# Altium project powerboard.PrjPcb
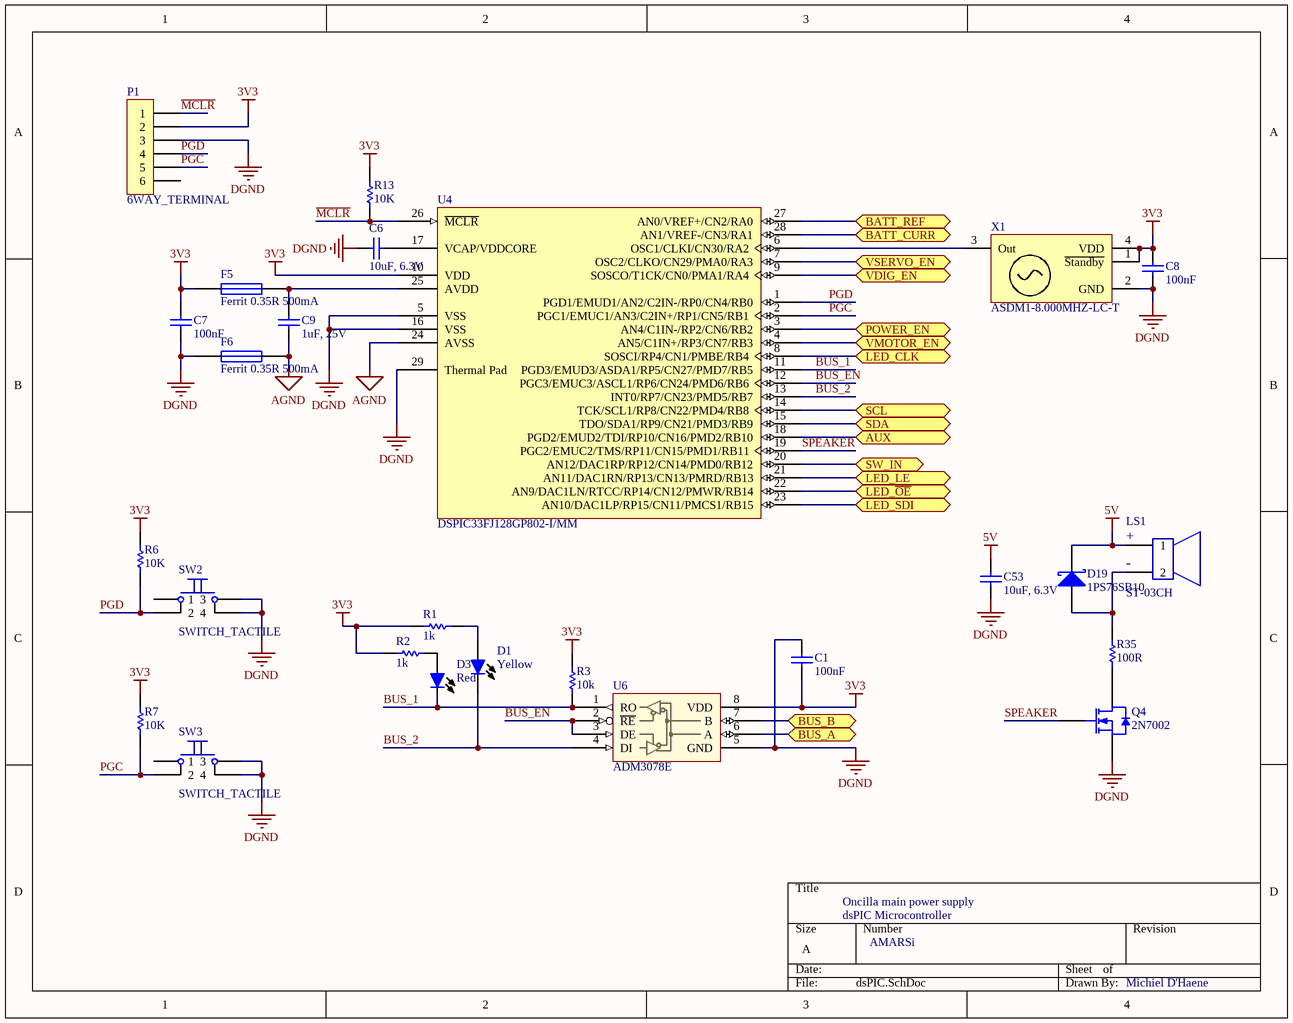
[diagram p0: dsPIC.SchDoc]
title: Vbusm (Biorob)
7 sheets, 154 parts. Net scope: flat (ports and power ports of the same name join across sheets).
Board file: powerboard_4layer.PcbDoc
Sheets:
  dsPIC.SchDoc
  Power_24V.SchDoc
  Connectors.SchDoc
  CurrentSensor.SchDoc
  Power_6V.SchDoc
  Power_onboard.SchDoc
  Leds.SchDoc

## Sheet dsPIC.SchDoc: Vbusm (Biorob)
size A

### Parts
C1  100nF  [CAPC1608L]
C6  10uF, 6.3V  [CAPC1608L]
C7  100nF  [CAPC1608L]
C8  100nF  [CAPC1608L]
C9  1uF, 25V  [CAPC1608L]
C53  value 10uF, 6.3V  [CAPC1608L]  (hidden comment: 1uF, 25V)
D1  Color: Yellow  [CD1608-0603]  (hidden comment: LED Yellow)
D3  Color: Red  [CD1608-0603]  (hidden comment: LED Red)
D19  1PS76SB10  [SOD323]
F5  Ferrit 0.35R 500mA  [RESC1608L]
F6  Ferrit 0.35R 500mA  [RESC1608L]
LS1  ST-03CH  [PIEZO_8.5x8.5MM]
P1  6WAY_TERMINAL  [MICROMATCH_6WAY_SE]
Q4  2N7002  [SOT23_N]
R1  1k  [RESC1608L]
R2  1k  [RESC1608L]
R3  10k  [RESC1608L]
R6  10k  [RESC1608L]
R7  10k  [RESC1608L]
R13  10k  [RESC1608L]
R35  100R  [RESC2012L]
SW2  SWITCH_TACTILE  [TACTILE_SWITCH]
SW3  SWITCH_TACTILE  [TACTILE_SWITCH]
U4  DSPIC33FJ128GP802-I/MM  [QFNS-MM28_N]
U6  ADM3078E  [SOIC-8_M]
X1  ASDM1-8.000MHZ-LC-T  [Crystal-Oscillator-2520]

### Ports
AUX, BATT_CURR, BATT_REF, BUS_A, BUS_B, LED_CLK, LED_LE, LED_SDI, LED_~{OE}, POWER_EN, SCL, SDA, SW_IN, VDIG_EN, VMOTOR_EN, VSERVO_EN

### Nets
3V3: C1.1 C7.2 C8.2 F5.1 P1.2 R1.1 R2.1 R3.2 R6.2 R7.2 R13.2 U4.10(VDD) U6.8(VDD) X1.1(~{Standby}) X1.4(VDD)
5V: C53.1 D19.1(K) LS1.1
AGND: C9.1 F6.2 U4.24(AVSS)
DGND: C1.2 C6.1 C7.1 C8.1 C53.2 F6.1 P1.3 Q4.2(S) SW2.3 SW2.4 SW3.3 SW3.4 U4.5(VSS) U4.16(VSS) U4.29(Thermal_Pad) U6.5(GND) X1.2(GND)
BUS_1: D3.2(C) R3.1 U4.11(PGD3/EMUD3/ASDA1/RP5/CN27/PMD7/RB5) U6.1(RO)
BUS_2: D1.2(C) U4.13(INT0/RP7/CN23/PMD5/RB7) U6.4(DI)
BUS_EN: U4.12(PGC3/EMUC3/ASCL1/RP6/CN24/PMD6/RB6) U6.2(~{RE}) U6.3(DE)
~{MCLR}: P1.1 R13.1 U4.26(~{MCLR})
PGC: P1.5 R7.1 SW3.2 U4.2(PGC1/EMUC1/AN3/C2IN+/RP1/CN5/RB1)
PGD: P1.4 R6.1 SW2.2 U4.1(PGD1/EMUD1/AN2/C2IN-/RP0/CN4/RB0)
SPEAKER: Q4.1(G) U4.19(PGC2/EMUC2/TMS/RP11/CN15/PMD1/RB11)
NetC4_2: U4.28(AN1/VREF-/CN3/RA1) ; port BATT_CURR
NetC6_2: C6.2 U4.17(VCAP/VDDCORE)
NetC9_2: C9.2 F5.2 U4.25(AVDD)
NetC43_2: U4.27(AN0/VREF+/CN2/RA0) ; port BATT_REF
NetD1_1: D1.1(A) R1.2
NetD3_1: D3.1(A) R2.2
NetD17_3: U4.20(AN12/DAC1RP/RP12/CN14/PMD0/RB12) ; port SW_IN
NetD19_2: D19.2(A) LS1.2 R35.1
NetP5_2: U6.6(A) ; port BUS_A
NetP5_3: U6.7(B) ; port BUS_B
NetP9_3: U4.14(TCK/SCL1/RP8/CN22/PMD4/RB8) ; port SCL
NetP9_4: U4.15(TDO/SDA1/RP9/CN21/PMD3/RB9) ; port SDA
NetP9_5: U4.18(PGD2/EMUD2/TDI/RP10/CN16/PMD2/RB10) ; port AUX
NetQ3_1: U4.3(AN4/C1IN-/RP2/CN6/RB2) ; port POWER_EN
NetQ4_3: Q4.3(D) R35.2
NetR37_2: U4.7(OSC2/CLKO/CN29/PMA0/RA3) ; port VSERVO_EN
NetR38_2: U4.9(SOSCO/T1CK/CN0/PMA1/RA4) ; port VDIG_EN
NetR39_2: U4.4(AN5/C1IN+/RP3/CN7/RB3) ; port VMOTOR_EN
NetU4_6: U4.6(OSC1/CLKI/CN30/RA2) X1.3(Out)
NetU4_8: U4.8(SOSCI/RP4/CN1/PMBE/RB4) ; port LED_CLK
NetU4_21: U4.21(AN11/DAC1RN/RP13/CN13/PMRD/RB13) ; port LED_LE
NetU4_22: U4.22(AN9/DAC1LN/RTCC/RP14/CN12/PMWR/RB14) ; port LED_~{OE}
NetU4_23: U4.23(AN10/DAC1LP/RP15/CN11/PMCS1/RB15) ; port LED_SDI

Not connected (* = marked no-connect by the designer): P1 6; SW2 1; SW3 1

### Notes on the sheet
- Oncilla main power supply
- dsPIC Microcontroller
- AMARSi
- Michiel D'Haene
- (in symbol piezo_sounder) +; -

### Library data of the parts
C1 C6-C9 C53 = Cap Semi: Capacitor (Semiconductor SIM Model); Published: 8-Jun-2000; LatestRevisionDate: 29-May-2009; LatestRevisionNote: IPC-7351 Footprint Added.; PackageReference: C1206; Publisher: Altium Limited; PackageDescription: Chip Capacitor
  C1 C7 C8: Value: 100nF
  C6: Value: 10uF, 6.3V
  C9: Value: 1uF, 25V
D1 D3 = LED
D19 = 1PS76SB10: Schottky Barrier Diode; Published: 17-Sep-2003; LatestRevisionDate: 19-Mar-2004; LatestRevisionNote: Silkscreen size reduced.; DatasheetVersion: 14-Oct-1996; PackageVersion: May-1999; PackageReference: SOD323; Publisher: Altium Limited; PackageDescription: SOD-323/SC-76; 2 Leads; Body 1.7 x 1.3 mm, (LxW); ComponentLink1Description: Manufacturer Link; ComponentLink1URL: http://www.semiconductors.philips.com/; ComponentLink2Description: Datasheet; ComponentLink2URL: http://www.semiconductors.philips.com/acrobat/datasheets/1PS76SB10_2.pdf
F5 F6 = Fuse 1: Ferrit Bead; Published: 8-Jun-2000; LatestRevisionDate: 17-Jul-2002; LatestRevisionNote: Re-released for DXP Platform.; PackageReference: PIN-W2/E2.8; Publisher: Altium Limited
LS1 = piezo_sounder
Q4 = BST82: N-channel Enhancement Mode Field-effect Transistor; Published: 17-Sep-2003; LatestRevisionDate: 12-Dec-2006; LatestRevisionNote: IPC-7351 Footprint Added.; DatasheetVersion: 26-Jul-2000; PackageVersion: May-1999; PackageReference: SOT23; Publisher: Altium Limited; PackageDescription: 3-Pin SOT-23 Package 0.95 mm Pitch, 2.3 mm Lead Span; ComponentLink1Description: Manufacturer Link; ComponentLink1URL: http://www.semiconductors.philips.com/; ComponentLink2Description: Datasheet; ComponentLink2URL: http://www.semiconductors.philips.com/acrobat/datasheets/BST82-03.pdf
R1-R3 R6 R7 R13 R35 = Res Semi: Semiconductor Resistor; Published: 8-Jun-2000; LatestRevisionDate: 17-Jul-2002; LatestRevisionNote: Re-released for DXP Platform.; PackageReference: AXIAL-0.5; Publisher: Altium Limited
  R1 R2: Value: 1k
  R3: Value: 10k
  R6 R7 R13: Value: 10K
  R35: Value: 100R
U4 = DSPIC33FJ128GP802T-I/MM: High-Performance 16-bit Digital Signal Controller, 128 KB Flash, 16 KB RAM, 28-Pin QFN, Industrial Temperature, Tape and Reel; FirstPublished: 29-Jan-2009; LatestRevisionDate: 02-Dec-2009; LatestRevisionNote: Updated to datasheet revision D, Nov-2009; DatasheetVersion: revD, Nov-2009; PackageVersion: revBB, Aug-2009; PackageReference: QFNS-MM28; Publisher: Altium Limited; PackageDescription: 28-Lead Plastic Quad Flat, No Lead Package (MM) - 6x6x0.9 mm Body [QFN-S] with 0.40 mm Contact Length; Supplier 1: Digi-Key; Supplier Part Number 1: DSPIC33FJ128GP802T-I/MMTR-ND; Supplier 2: Newark; Supplier Part Number 2: 54M4502; ComponentLink1Description: Datasheet; ComponentLink1URL: http://ww1.microchip.com/downloads/en/DeviceDoc/70292D.pdf; ComponentLink2Description: Packaging Specification; ComponentLink2URL: http://www.microchip.com/stellent/groups/techpub_sg/documents/packagingspec/en012702.pdf; ComponentLink3Description: Microchip.com Home; ComponentLink3URL: http://www.microchip.com/
U6 = ADM3078E: Half-Duplex RS485 Transciever, 3.3V, 16Mbps
X1 = Oscillator: Name: ASDM1; Value: 8MHz

## Sheet Power_24V.SchDoc: Vbusm (Biorob)
size A4; DocumentNumber: 2; SheetNumber: 2; SheetTotal: 4
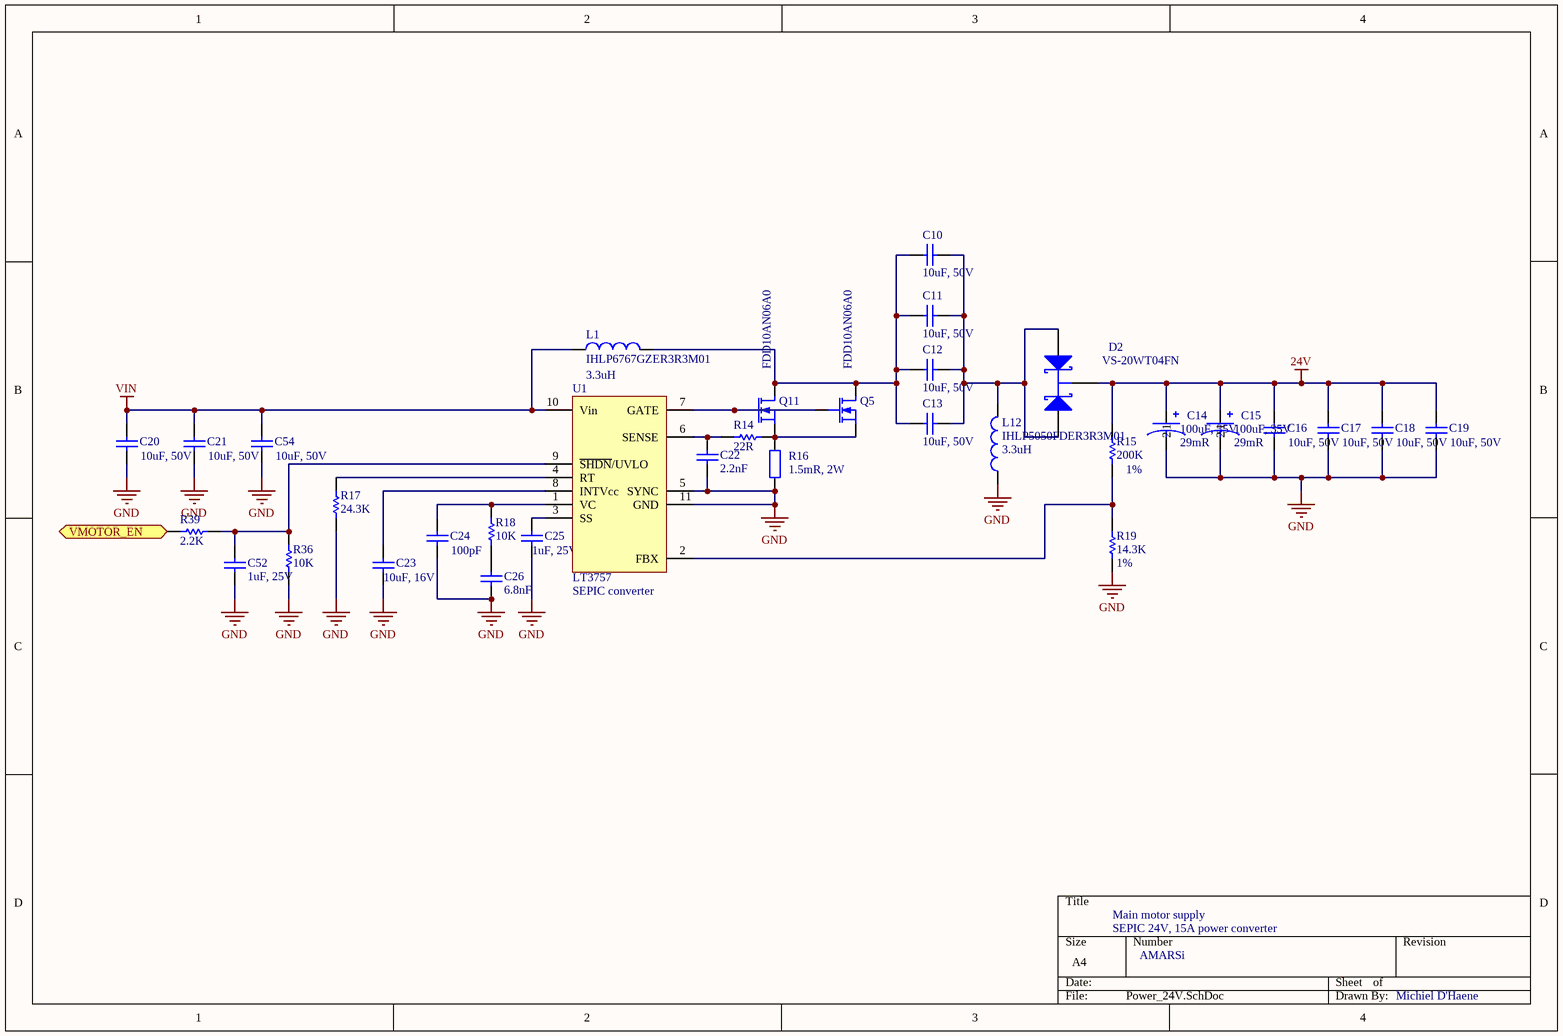
[diagram p1: Power_24V.SchDoc]

### Parts
C10  10uF, 50V  [CAPC3216L]
C11  10uF, 50V  [CAPC3216L]
C12  10uF, 50V  [CAPC3216L]
C13  10uF, 50V  [CAPC3216L]
C14  value 100uF, 35V  ESR: 29mR  [CAP_POL_SMD_SIZE_G]  (hidden comment: 100uF, 35V, 29mR)
C15  value 100uF, 35V  ESR: 29mR  [CAP_POL_SMD_SIZE_G]  (hidden comment: 100uF, 35V, 29mR)
C16  10uF, 50V  [CAPC3216L]
C17  10uF, 50V  [CAPC3216L]
C18  10uF, 50V  [CAPC3216L]
C19  10uF, 50V  [CAPC3216L]
C20  10uF, 50V  [CAPC3216L]
C21  10uF, 50V  [CAPC3216L]
C22  2.2nF  [CAPC1608L]
C23  10uF, 16V  [CAPC2512L]
C24  100pF  [CAPC1608L]
C25  1uF, 25V  [CAPC1608L]
C26  6.8nF  [CAPC1608L]
C52  1uF, 25V  [CAPC1608L]
C54  10uF, 50V  [CAPC3216L]
D2  VS-20WT04FN  [TO-252AA]
L1  IHLP6767GZER3R3M01  value 3.3uH  [IHLP-6767GZ]
L12  IHLP5050FDER3R3M01  value 3.3uH  [IHLP5050]
Q5  FDD10AN06A0  [TO-252A DPak]
Q11  FDD10AN06A0  [TO-252A DPak]
R14  22R  [RESC1608L]
R15  value 200K  Precision: 1%  [RESC1608L]  (hidden comment: 200K, 1%)
R16  1.5mR, 2W  [RESC6332N]
R17  24.3K  [RESC1608L]
R18  10K  [RESC1608L]
R19  value 14.3K  Precision: 1%  [RESC1608L]  (hidden comment: 14.3K, 1%)
R36  10K  [RESC1608L]
R39  2.2k  [RESC1608L]
U1  LT3757  [MSOP-10-TP]

### Ports
VMOTOR_EN

### Nets
24V: C14.2 C15.2 C16.2 C17.2 C18.2 C19.2 D2.4(K) R15.2
GND: C14.1 C15.1 C16.1 C17.1 C18.1 C19.1 C20.1 C21.1 C22.1 C23.1 C24.1 C25.1 C26.1 C52.1 C54.1 L12.1 R16.1 R17.1 R19.1 R36.1 U1.5(SYNC) U1.11(GND)
VIN: C20.2 C21.2 C54.2 L1.1 U1.10(Vin)
NetC10_1: C10.1 C11.1 C12.1 C13.1 D2.1(A1) D2.3(A2) L12.2
NetC10_2: C10.2 C11.2 C12.2 C13.2 L1.2 Q5.D Q11.D
NetC22_2: C22.2 R14.1 U1.6(SENSE)
NetC23_2: C23.2 U1.8(INTVcc)
NetC24_2: C24.2 R18.2 U1.1(VC)
NetC25_2: C25.2 U1.3(SS)
NetC26_2: C26.2 R18.1
NetC52_2: C52.2 R36.2 R39.1 U1.9(~{SHDN}/UVLO)
NetQ5_G: Q5.G Q11.G U1.7(GATE)
NetQ5_S: Q5.S Q11.S R14.2 R16.2
NetR15_1: R15.1 R19.2 U1.2(FBX)
NetR17_2: R17.2 U1.4(RT)
NetR39_2: R39.2 ; port VMOTOR_EN

### Notes on the sheet
- (near U1) SEPIC converter
- Main motor supply
- SEPIC 24V, 15A power converter
- AMARSi
- Michiel D'Haene

### Library data of the parts
C10-C13 C16-C22 C52 C54 = Cap Semi: Capacitor (Semiconductor SIM Model); Published: 8-Jun-2000; LatestRevisionDate: 29-May-2009; LatestRevisionNote: IPC-7351 Footprint Added.; PackageReference: C1206; Publisher: Altium Limited; PackageDescription: Chip Capacitor
  C10-C13 C16-C21 C54: Value: 10uF; Voltage: 50V
  C22: Value: 2.2nF
  C52: Value: 1uF, 25V
C14 C15 = CAP_POL
C23 = Cap Semi: Capacitor (Semiconductor SIM Model); Voltage: 10V; Published: 8-Jun-2000; LatestRevisionDate: 29-May-2009; LatestRevisionNote: IPC-7351 Footprint Added.; PackageReference: C0805; Publisher: Altium Limited; PackageDescription: Chip Capacitor; Value: 10uF
C24-C26 = Cap: Capacitor; Published: 8-Jun-2000; LatestRevisionDate: 17-Jul-2002; LatestRevisionNote: Re-released for DXP Platform.; PackageReference: RAD-0.3; Publisher: Altium Limited
  C25: Value: 1uF, 25V
D2 = 12CWQ06FN: Schottky Rectifier; Note: Pin 2 is trimmed and not drawn; Published: 8-Jun-2000; LatestRevisionDate: 17-Jul-2002; LatestRevisionNote: Re-released for DXP Platform.; DatasheetDocument: Apr-1997; PackageDocument: Feb-2003; PackageReference: TO-252AA; Publisher: Altium Limited; Code_JEDEC: TO-252-AA; ComponentLink1Description: Manufacturer Link; ComponentLink1URL: http://www.irf.com/; ComponentLink2Description: Datasheet; ComponentLink2URL: http://www.irf.com/product-info/datasheets/data/12cwq06fn.pdf
L1 = Inductor
L12 = Inductor: Code_IEC: 1005; Published: 8-Jun-2000; LatestRevisionDate: 17-Jul-2002; LatestRevisionNote: Re-released for DXP Platform.; PackageReference: 0402-A; Publisher: Altium Limited; Code_JEITA: 0402
Q5 Q11 = nFET: N-Channel MOSFET; pin to pad: D>4 G>1 S>3
R14 R15 R17-R19 R36 = Res Semi: Semiconductor Resistor; Published: 8-Jun-2000; LatestRevisionDate: 17-Jul-2002; LatestRevisionNote: Re-released for DXP Platform.; PackageReference: AXIAL-0.5; Publisher: Altium Limited
  R14: Value: 22R
  R17: Value: 24.3K
  R18 R36: Value: 10K
R16 = Res2: Resistor; Published: 8-Jun-2000; LatestRevisionDate: 17-Jul-2002; LatestRevisionNote: Re-released for DXP Platform.; PackageReference: AXIAL-0.4; Publisher: Altium Limited; Value: 1.5mR, 2W
R39 = Res Semi: Semiconductor Resistor; Precision: 5%; Published: 8-Jun-2000; LatestRevisionDate: 17-Jul-2002; LatestRevisionNote: Re-released for DXP Platform.; PackageReference: AXIAL-0.5; Publisher: Altium Limited; Value: 2.2K
U1 = LT3757: 2.9-40V SEPIC, Flyback, Boost and Inverting Converter with external switch

## Sheet Connectors.SchDoc: Vbusm (Biorob)
size A4; DocumentNumber: 4; SheetNumber: 4; SheetTotal: 4
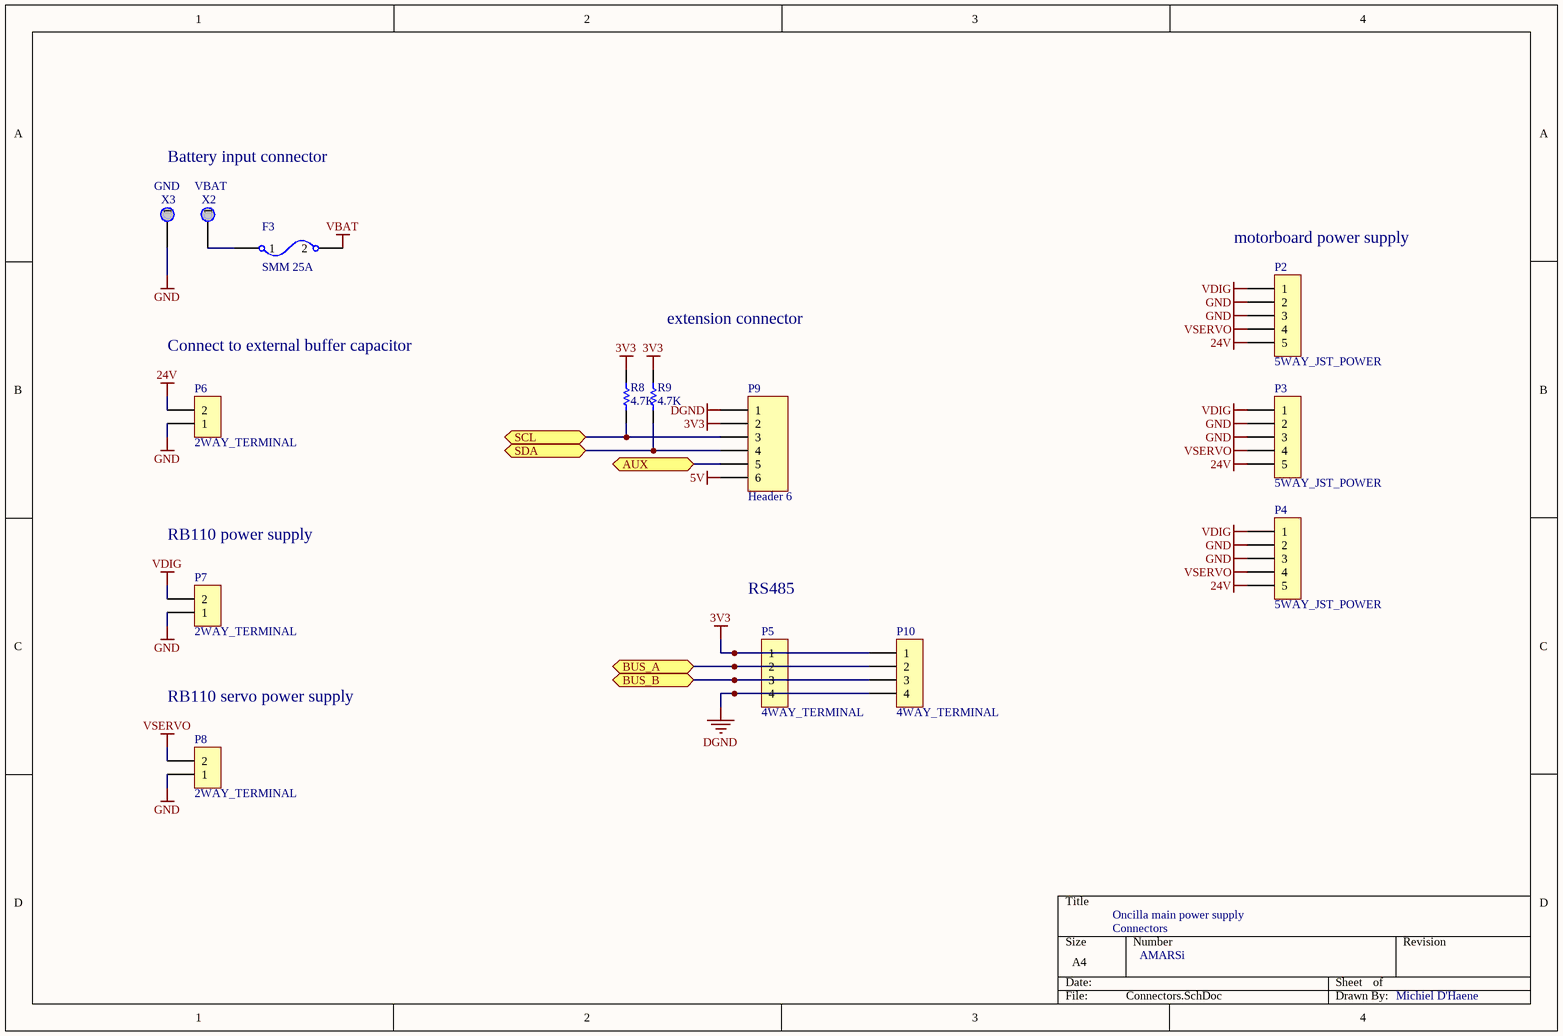
[diagram p2: Connectors.SchDoc]

### Parts
F3  SMM 25A  [FUSE SMM]
P2  5WAY_JST_POWER  [TERMINAL_5WAY_35]
P3  5WAY_JST_POWER  [TERMINAL_5WAY_35]
P4  5WAY_JST_POWER  [TERMINAL_5WAY_35]
P5  4WAY_TERMINAL  [MICROMATCH_4WAY_SE]
P6  2WAY_TERMINAL  [TYCO_2WAY_35MM]
P7  2WAY_TERMINAL  [TYCO_2WAY_35MM]
P8  2WAY_TERMINAL  [TYCO_2WAY_35MM]
P9  Header 6  [HDR1X6]
P10  4WAY_TERMINAL  [MICROMATCH_4WAY_SE]
R8  4.7k  [RESC1608L]
R9  4.7k  [RESC1608L]
X2  VBAT  [TESTPIN 2MM]
X3  GND  [TESTPIN 2MM]

### Ports
AUX, BUS_A, BUS_B, SCL, SDA

### Nets
3V3: P5.1 P9.2 P10.1 R8.2 R9.2
5V: P9.6
24V: P2.5 P3.5 P4.5 P6.2
DGND: P5.4 P9.1 P10.4
GND: P2.2 P2.3 P3.2 P3.3 P4.2 P4.3 P6.1 P7.1 P8.1 X3.1
VBAT: F3.2
VDIG: P2.1 P3.1 P4.1 P7.2
VSERVO: P2.4 P3.4 P4.4 P8.2
NetF3_1: F3.1 X2.1
NetP5_2: P5.2 P10.2 ; port BUS_A
NetP5_3: P5.3 P10.3 ; port BUS_B
NetP9_3: P9.3 R8.1 ; port SCL
NetP9_4: P9.4 R9.1 ; port SDA
NetP9_5: P9.5 ; port AUX

### Notes on the sheet
- Battery input connector
- (near P2) motorboard power supply
- Connect to external buffer capacitor
- extension connector
- RB110 power supply
- RS485
- RB110 servo power supply
- Oncilla main power supply
- Connectors
- AMARSi
- Michiel D'Haene

### Library data of the parts
F3 = fuse
P9 = Header 6: Header, 6-Pin; LatestRevisionDate: 17-Jul-2002; LatestRevisionNote: Re-released for DXP Platform.; Publisher: Altium Limited
R8 R9 = Res Semi: Semiconductor Resistor; Published: 8-Jun-2000; LatestRevisionDate: 17-Jul-2002; LatestRevisionNote: Re-released for DXP Platform.; PackageReference: AXIAL-0.5; Publisher: Altium Limited; Value: 4.7K
X2 X3 = 1WAY_TERMINAL

## Sheet CurrentSensor.SchDoc: Vbusm (Biorob)
size A4; DocumentNumber: 3; SheetNumber: 3; SheetTotal: 4
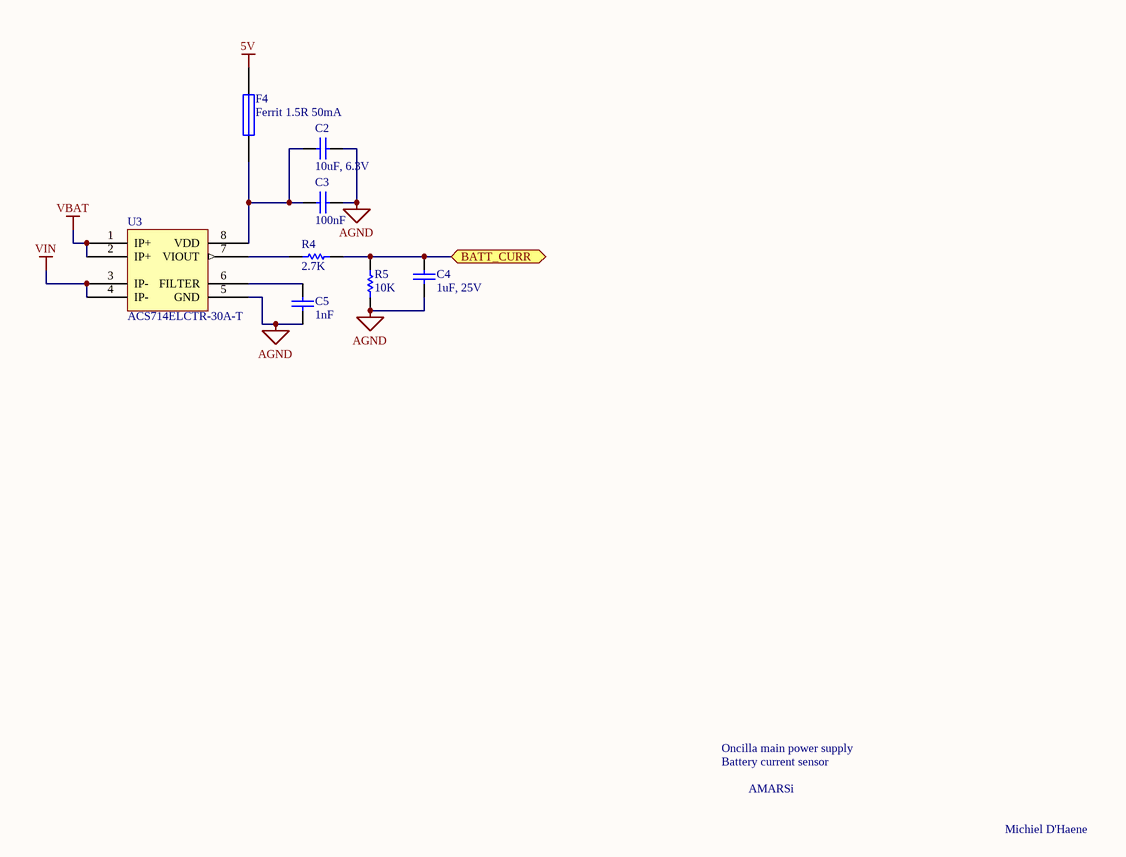
[diagram p3: CurrentSensor.SchDoc]

### Parts
C2  10uF, 6.3V  [CAPC1608L]
C3  100nF  [CAPC1608L]
C4  1uF, 25V  [CAPC1608L]
C5  1nF  [CAPC1608L]
F4  Ferrit 1.5R 50mA  [RESC1608L]
R4  2.7k  [RESC1608L]
R5  10k  [RESC1608L]
U3  ACS714ELCTR-30A-T  [SOIC-8_M]

### Ports
BATT_CURR

### Nets
5V: F4.2
AGND: C2.2 C3.2 C4.1 C5.1 R5.1 U3.5(GND)
VBAT: U3.1(IP+) U3.2(IP+)
VIN: U3.3(IP-) U3.4(IP-)
NetC2_1: C2.1 C3.1 F4.1 U3.8(VDD)
NetC4_2: C4.2 R4.1 R5.2 ; port BATT_CURR
NetC5_2: C5.2 U3.6(FILTER)
NetR4_2: R4.2 U3.7(VIOUT)

### Notes on the sheet
- Oncilla main power supply
- Battery current sensor
- AMARSi
- Michiel D'Haene

### Library data of the parts
C2-C5 = Cap Semi: Capacitor (Semiconductor SIM Model); Published: 8-Jun-2000; LatestRevisionDate: 29-May-2009; LatestRevisionNote: IPC-7351 Footprint Added.; PackageReference: C1206; Publisher: Altium Limited; PackageDescription: Chip Capacitor
  C2: Value: 10uF, 6.3V
  C3: Value: 100nF
  C4: Value: 1uF, 25V
  C5: Value: 1nF
F4 = Fuse 1: Ferrit Bead; Published: 8-Jun-2000; LatestRevisionDate: 17-Jul-2002; LatestRevisionNote: Re-released for DXP Platform.; PackageReference: PIN-W2/E2.8; Publisher: Altium Limited
R4 R5 = Res Semi: Semiconductor Resistor; Published: 8-Jun-2000; LatestRevisionDate: 17-Jul-2002; LatestRevisionNote: Re-released for DXP Platform.; PackageReference: AXIAL-0.5; Publisher: Altium Limited
  R4: Value: 2.7K
  R5: Value: 10K
U3 = ACS714: Hall Effect-Based Linear Current Sensor

## Sheet Power_6V.SchDoc: Vbusm (Biorob)
size A
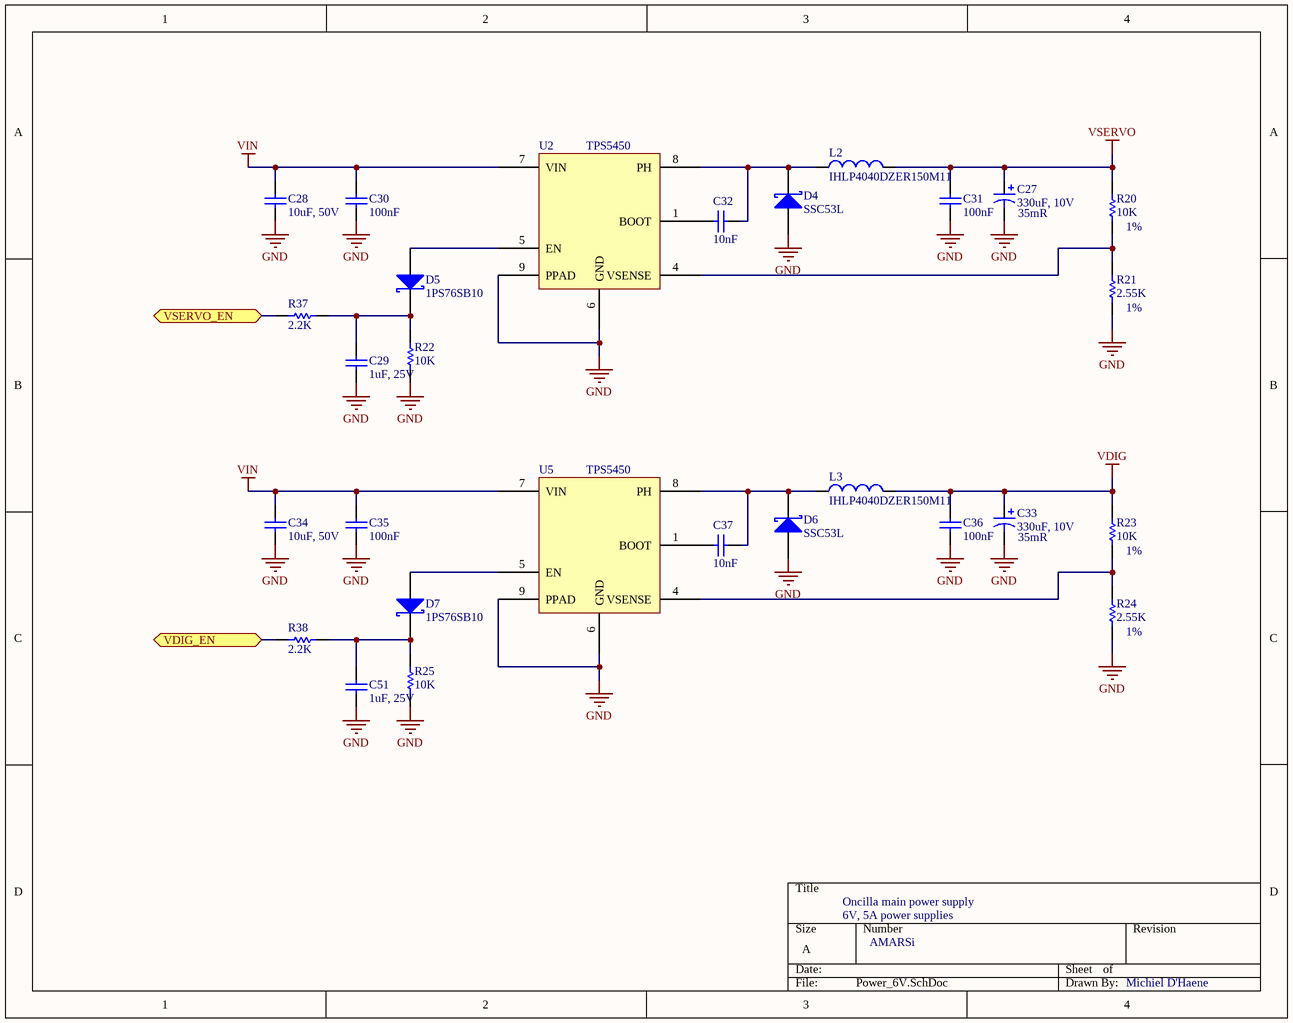
[diagram p4: Power_6V.SchDoc]

### Parts
C27  ESR: 35mR  [7343]  (hidden comment: 330uF, 10V)
C28  10uF, 50V  [CAPC3216L]
C29  1uF, 25V  [CAPC1608L]
C30  100nF  [CAPC1608L]
C31  100nF  [CAPC1608L]
C32  10nF  [CAPC1608L]
C33  ESR: 35mR  [7343]  (hidden comment: 330uF, 10V)
C34  10uF, 50V  [CAPC3216L]
C35  100nF  [CAPC1608L]
C36  100nF  [CAPC1608L]
C37  10nF  [CAPC1608L]
C51  1uF, 25V  [CAPC1608L]
D4  SSC53L  [SMC]
D5  1PS76SB10  [SOD323]
D6  SSC53L  [SMC]
D7  1PS76SB10  [SOD323]
L2  IHLP4040DZER150M11  [IHLP-4040DZ]
L3  IHLP4040DZER150M11  [IHLP-4040DZ]
R20  value 10K  Precision: 1%  [RESC1608L]  (hidden comment: 10k, 1%)
R21  value 2.55K  Precision: 1%  [RESC1608L]  (hidden comment: 2.55k, 1%)
R22  10k  [RESC1608L]
R23  value 10K  Precision: 1%  [RESC1608L]  (hidden comment: 10k, 1%)
R24  value 2.55K  Precision: 1%  [RESC1608L]  (hidden comment: 2.55k, 1%)
R25  10k  [RESC1608L]
R37  2.2k  [RESC1608L]
R38  2.2k  [RESC1608L]
U2  TPS5450  [SOIC8 POWERPAD]
U5  TPS5450  [SOIC8 POWERPAD]

### Ports
VDIG_EN, VSERVO_EN

### Nets
GND: C27.2 C28.1 C29.1 C30.1 C31.1 C33.2 C34.1 C35.1 C36.1 C51.1 D4.1(A) D6.1(A) R21.1 R22.1 R24.1 R25.1 U2.6(GND) U2.9(PPAD) U5.6(GND) U5.9(PPAD)
VDIG: C33.1 C36.2 L3.2 R23.2
VIN: C28.2 C30.2 C34.2 C35.2 U2.7(VIN) U5.7(VIN)
VSERVO: C27.1 C31.2 L2.2 R20.2
NetC29_2: C29.2 D5.1(K) R22.2 R37.1
NetC32_1: C32.1 U2.1(BOOT)
NetC32_2: C32.2 D4.2(K) L2.1 U2.8(PH)
NetC37_1: C37.1 U5.1(BOOT)
NetC37_2: C37.2 D6.2(K) L3.1 U5.8(PH)
NetC51_2: C51.2 D7.1(K) R25.2 R38.1
NetD5_2: D5.2(A) U2.5(EN)
NetD7_2: D7.2(A) U5.5(EN)
NetR20_1: R20.1 R21.2 U2.4(VSENSE)
NetR23_1: R23.1 R24.2 U5.4(VSENSE)
NetR37_2: R37.2 ; port VSERVO_EN
NetR38_2: R38.2 ; port VDIG_EN

### Notes on the sheet
- Oncilla main power supply
- 6V, 5A power supplies
- AMARSi
- Michiel D'Haene

### Library data of the parts
C27 C33 = 255D157X06R3D2T045: Note: See Data Sheet for full range of components; Published: 19-Mar-2004; DatasheetDocument: 04-Feb-2003; PackageReference: 7343; Publisher: Altium Limited; Code_JEITA: 7343; ComponentLink1Description: Manufacturer Link; ComponentLink1URL: http://www.vishay.com/; ComponentLink2Description: Datasheet; ComponentLink2URL: http://www.vishay.com/docs/40052/255d.pdf; Value: 330uF, 10V
C28-C32 C34-C37 C51 = Cap Semi: Capacitor (Semiconductor SIM Model); Published: 8-Jun-2000; LatestRevisionDate: 29-May-2009; LatestRevisionNote: IPC-7351 Footprint Added.; PackageReference: C1206; Publisher: Altium Limited; PackageDescription: Chip Capacitor
  C28 C34: Value: 10uF, 50V
  C29 C51: Value: 1uF, 25V
  C30 C31 C35 C36: Value: 100nF
  C32 C37: Value: 10nF
D4 D6 = 30BQ040: Schottky Rectifier; Published: 8-Jun-2000; LatestRevisionDate: 17-Jul-2002; LatestRevisionNote: Re-released for DXP Platform.; DatasheetDocument: PD-2.439; PackageReference: SMC; Publisher: Altium Limited; Code_JEDEC: DO-214-AB; ComponentLink1Description: Manufacturer Link; ComponentLink1URL: http://www.irf.com/; ComponentLink2Description: Datasheet; ComponentLink2URL: http://www.irf.com/product-info/datasheets/data/30bq040.pdf
D5 D7 = 1PS76SB10: Schottky Barrier Diode; Published: 17-Sep-2003; LatestRevisionDate: 19-Mar-2004; LatestRevisionNote: Silkscreen size reduced.; DatasheetVersion: 14-Oct-1996; PackageVersion: May-1999; PackageReference: SOD323; Publisher: Altium Limited; PackageDescription: SOD-323/SC-76; 2 Leads; Body 1.7 x 1.3 mm, (LxW); ComponentLink1Description: Manufacturer Link; ComponentLink1URL: http://www.semiconductors.philips.com/; ComponentLink2Description: Datasheet; ComponentLink2URL: http://www.semiconductors.philips.com/acrobat/datasheets/1PS76SB10_2.pdf
L2 L3 = Inductor
R20 R21 R23 R24 = Res Semi: Semiconductor Resistor; Published: 8-Jun-2000; LatestRevisionDate: 17-Jul-2002; LatestRevisionNote: Re-released for DXP Platform.; PackageReference: AXIAL-0.5; Publisher: Altium Limited
R22 R25 R37 R38 = Res Semi: Semiconductor Resistor; Precision: 5%; Published: 8-Jun-2000; LatestRevisionDate: 17-Jul-2002; LatestRevisionNote: Re-released for DXP Platform.; PackageReference: AXIAL-0.5; Publisher: Altium Limited
  R22 R25: Value: 10K
  R37 R38: Value: 2.2K

## Sheet Power_onboard.SchDoc: Vbusm (Biorob)
size A
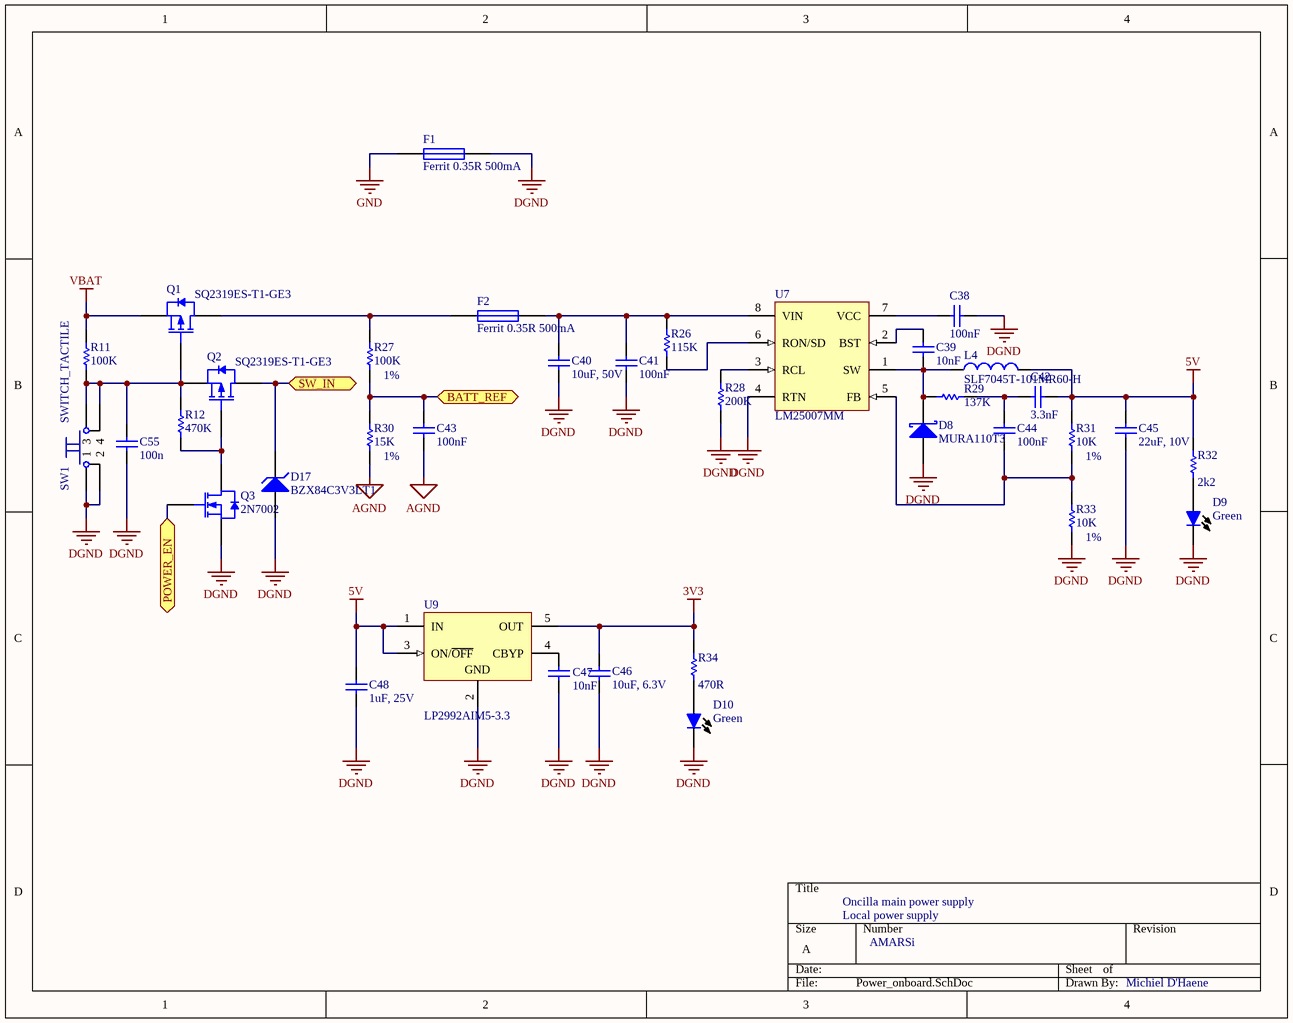
[diagram p5: Power_onboard.SchDoc]

### Parts
C38  100nF  [CAPC1608L]
C39  10nF  [CAPC1608L]
C40  10uF, 50V  [CAPC3216L]
C41  100nF  [CAPC1608L]
C42  3.3nF  [CAPC1608L]
C43  100nF  [CAPC1608L]
C44  value 100nF  [CAPC1608L]  (hidden comment: 22nF)
C45  22uF, 10V  [CAPC3216L]
C46  10uF, 6.3V  [CAPC1608L]
C47  10nF  [CAPC1608L]
C48  1uF, 25V  [CAPC1608L]
C55  100n  [CAPC1608L]
D8  MURA110T3  [SMA]
D9  Color: Green  [CD1608-0603]  (hidden comment: LED Green)
D10  Color: Green  [CD1608-0603]  (hidden comment: LED Green)
D17  BZX84C3V3LT1  [318-07]
F1  Ferrit 0.35R 500mA  [RESC1608L]
F2  Ferrit 0.35R 500mA  [RESC1608L]
L4  SLF7045T-101MR60-H  [SLF7045T]
Q1  SQ2319ES-T1-GE3  [SOT23_N]
Q2  SQ2319ES-T1-GE3  [SOT23_N]
Q3  2N7002  [SOT23_N]
R11  100k  [RESC1608L]
R12  value 470K  [RESC1608L]  (hidden comment: 100k)
R26  115k  [RESC1608L]
R27  value 100K  Precision: 1%  [RESC1608L]  (hidden comment: 100k, 1%)
R28  200k  [RESC1608L]
R29  value 137K  [RESC1608L]  (hidden comment: 138k)
R30  value 15K  Precision: 1%  [RESC1608L]  (hidden comment: 15k, 1%)
R31  value 10K  Precision: 1%  [RESC1608L]  (hidden comment: 10k, 1%)
R32  2k2  [RESC1608L]
R33  value 10K  Precision: 1%  [RESC1608L]  (hidden comment: 10k, 1%)
R34  470R  [RESC1608L]
SW1  SWITCH_TACTILE  [TACTILE_SWITCH]
U7  LM25007MM  [MUA08A_N]
U9  LP2992AIM5-3.3  [MF05A_N]

### Ports
BATT_REF, POWER_EN, SW_IN

### Nets
3V3: C46.2 R34.2 U9.5(OUT)
5V: C42.2 C45.2 C48.2 L4.2 R31.2 R32.2 U9.1(IN) U9.3(ON/~{OFF})
AGND: C43.1 R30.1
DGND: C38.1 C40.1 C41.1 C45.1 C46.1 C47.1 C48.1 C55.1 D8.1(A) D9.2(C) D10.2(C) D17.1(A) F1.2 Q3.2(S) R28.1 R33.1 SW1.1 SW1.2 U7.4(RTN) U9.2(GND)
GND: F1.1
VBAT: Q1.2(S) R11.2
NetC38_2: C38.2 U7.7(VCC)
NetC39_1: C39.1 D8.2(K) L4.1 R29.2 U7.1(SW)
NetC39_2: C39.2 U7.2(BST)
NetC40_2: C40.2 C41.2 F2.2 R26.2 U7.8(VIN)
NetC42_1: C42.1 C44.2 R29.1
NetC43_2: C43.2 R27.1 R30.2 ; port BATT_REF
NetC44_1: C44.1 R31.1 R33.2 U7.5(FB)
NetC47_2: C47.2 U9.4(CBYP)
NetC55_2: C55.2 Q1.1(G) Q2.2(S) R11.1 R12.2 SW1.3 SW1.4
NetD9_1: D9.1(A) R32.1
NetD10_1: D10.1(A) R34.1
NetD17_3: D17.3(K) Q2.3(D) ; port SW_IN
NetF2_1: F2.1 Q1.3(D) R27.2
NetQ2_1: Q2.1(G) Q3.3(D) R12.1
NetQ3_1: Q3.1(G) ; port POWER_EN
NetR26_1: R26.1 U7.6(RON/SD)
NetR28_2: R28.2 U7.3(RCL)

### Notes on the sheet
- Oncilla main power supply
- Local power supply
- AMARSi
- Michiel D'Haene

### Library data of the parts
C38-C48 C55 = Cap Semi: Capacitor (Semiconductor SIM Model); Published: 8-Jun-2000; LatestRevisionDate: 29-May-2009; LatestRevisionNote: IPC-7351 Footprint Added.; PackageReference: C1206; Publisher: Altium Limited; PackageDescription: Chip Capacitor
  C38 C41 C43: Value: 100nF
  C39 C47: Value: 10nF
  C40: Value: 10uF, 50V
  C42: Value: 3.3nF
  C45: Value: 22uF, 10V
  C46: Value: 10uF, 6.3V
  C48: Value: 1uF, 25V
  C55: Value: 100n
D8 = 10MQ060N: Schottky Rectifier; PackageDocument: revH, May-2002; Published: 17-Sep-2003; DatasheetDocument: May-2002; PackageReference: SMA; Publisher: Altium Limited; ComponentLink1Description: Manufacturer Link; ComponentLink1URL: http://www.irf.com/; ComponentLink2Description: Datasheet; ComponentLink2URL: http://www.irf.com/product-info/datasheets/data/10MQ060N.pdf
D9 D10 = LED
D17 = BZX84C3V3LT1: Zener Voltage Regulator Diode; Note: Pin 2 is not connected and not drawn.; Published: 29-Sep-2000; LatestRevisionDate: 17-Jul-2002; LatestRevisionNote: Re-released for DXP Platform.; PackageReference: 318-07; Publisher: Altium Limited; PackageDescription: SOT-23; 3 Leads; Body 3.0 x 2.5 mm, inc. leads (LxW max); ComponentLink1Description: Manufacturer Link; ComponentLink1URL: http://www.onsemi.com/site/products/landing?taxonomyID=194; ComponentLink2Description: Datasheet; ComponentLink2URL: http://www.onsemi.com/pub/Collateral/BZX84C2V4LT1-D.PDF
F1 F2 = Fuse 1: Ferrit Bead; Published: 8-Jun-2000; LatestRevisionDate: 17-Jul-2002; LatestRevisionNote: Re-released for DXP Platform.; PackageReference: PIN-W2/E2.8; Publisher: Altium Limited
L4 = Inductor
Q1 Q2 = BSS84: P-channel Enhancement Mode Vertical D-MOSFET; Published: 17-Sep-2003; LatestRevisionDate: 12-Dec-2006; LatestRevisionNote: IPC-7351 Footprint Added.; DatasheetVersion: 18-Jun-1997; PackageVersion: May-1999; PackageReference: SOT23; Publisher: Altium Limited; PackageDescription: 3-Pin SOT-23 Package 0.95 mm Pitch, 2.3 mm Lead Span; ComponentLink1Description: Manufacturer Link; ComponentLink1URL: http://www.semiconductors.philips.com/; ComponentLink2Description: Datasheet; ComponentLink2URL: http://www.semiconductors.philips.com/acrobat/datasheets/BSS84_3.pdf
Q3 = BST82: as Q4 on sheet dsPIC; Published: 17-Sep-2003; LatestRevisionDate: 12-Dec-2006; LatestRevisionNote: IPC-7351 Footprint Added.; DatasheetVersion: 26-Jul-2000; PackageVersion: May-1999; PackageReference: SOT23; Publisher: Altium Limited; PackageDescription: 3-Pin SOT-23 Package 0.95 mm Pitch, 2.3 mm Lead Span; ComponentLink1Description: Manufacturer Link; ComponentLink1URL: http://www.semiconductors.philips.com/; ComponentLink2Description: Datasheet; ComponentLink2URL: http://www.semiconductors.philips.com/acrobat/datasheets/BST82-03.pdf
R11 R12 R26-R34 = Res Semi: Semiconductor Resistor; Published: 8-Jun-2000; LatestRevisionDate: 17-Jul-2002; LatestRevisionNote: Re-released for DXP Platform.; PackageReference: AXIAL-0.5; Publisher: Altium Limited
  R11: Value: 100K
  R26: Value: 115K
  R28: Value: 200K
  R32: Value: 2k2
  R34: Value: 470R
U7 = LM25007MM: 42V, 0.5A Step-Down Switching Regulator; Manufacturer: National Semiconductor; CompType: MiscPower; PackageTopMarking: ZXTT*SLYB; PowerWise: N; FirstPublished: 4-Dec-2008; DatasheetVersion: Feb-2008; PackageVersion: revF, Apr-2008; PackageReference: MUA08A; Publisher: Altium Limited; PackageDescription: MINI SOIC, .118 x .118 x .034in, 8 Lead, .0256in Pitch; PartNumber: LM25007MM; RoHS: Y; PinCount: 8; DigiKeyPartNumber: LM25007MMCT-ND; Code_JEDEC: MO-187-AA; ComponentLink1Description: LM25007 Datasheet; ComponentLink1URL: http://www.national.com/ds/LM/LM25007.pdf; ComponentLink2Description: LM25007 Web Page; ComponentLink2URL: http://www.national.com/pf/LM/LM25007.html; ComponentLink3Description: MUA08A Package Page; ComponentLink3URL: http://www.national.com/packaging/folders/mua08a.html
U9 = LP2992AIM5-5.0: Micropower 250 mA Low-Noise Ultra Low-Dropout Regulator in SOT-23 and LLP Packages; Manufacturer: National Semiconductor; CompType: LDO IC; PackageTopMarking: LFFA*XTT; PowerWise: N; Published: 4-Dec-2008; DatasheetVersion: May-2005; PackageVersion: revD, Aug-2008; PackageReference: MF05A; Publisher: Altium Limited; PackageDescription: Molded SOT-23, .115 x .063 x .040 in Body, 5 Lead, .0375 in Pitch; PartNumber: LP2992AIM5-5.0; RoHS: O; PinCount: 5; DigiKeyPartNumber: LP2992AIM5-5.0CT-ND; ComponentLink1Description: LP2992 Datasheet; ComponentLink1URL: http://www.national.com/ds/LP/LP2992.pdf; ComponentLink2Description: LP2992 Web Page; ComponentLink2URL: http://www.national.com/pf/LP/LP2992.html; ComponentLink3Description: MF05A Package Page; ComponentLink3URL: http://www.national.com/packaging/folders/mf05a.html

## Sheet Leds.SchDoc: Vbusm (Biorob)
size A
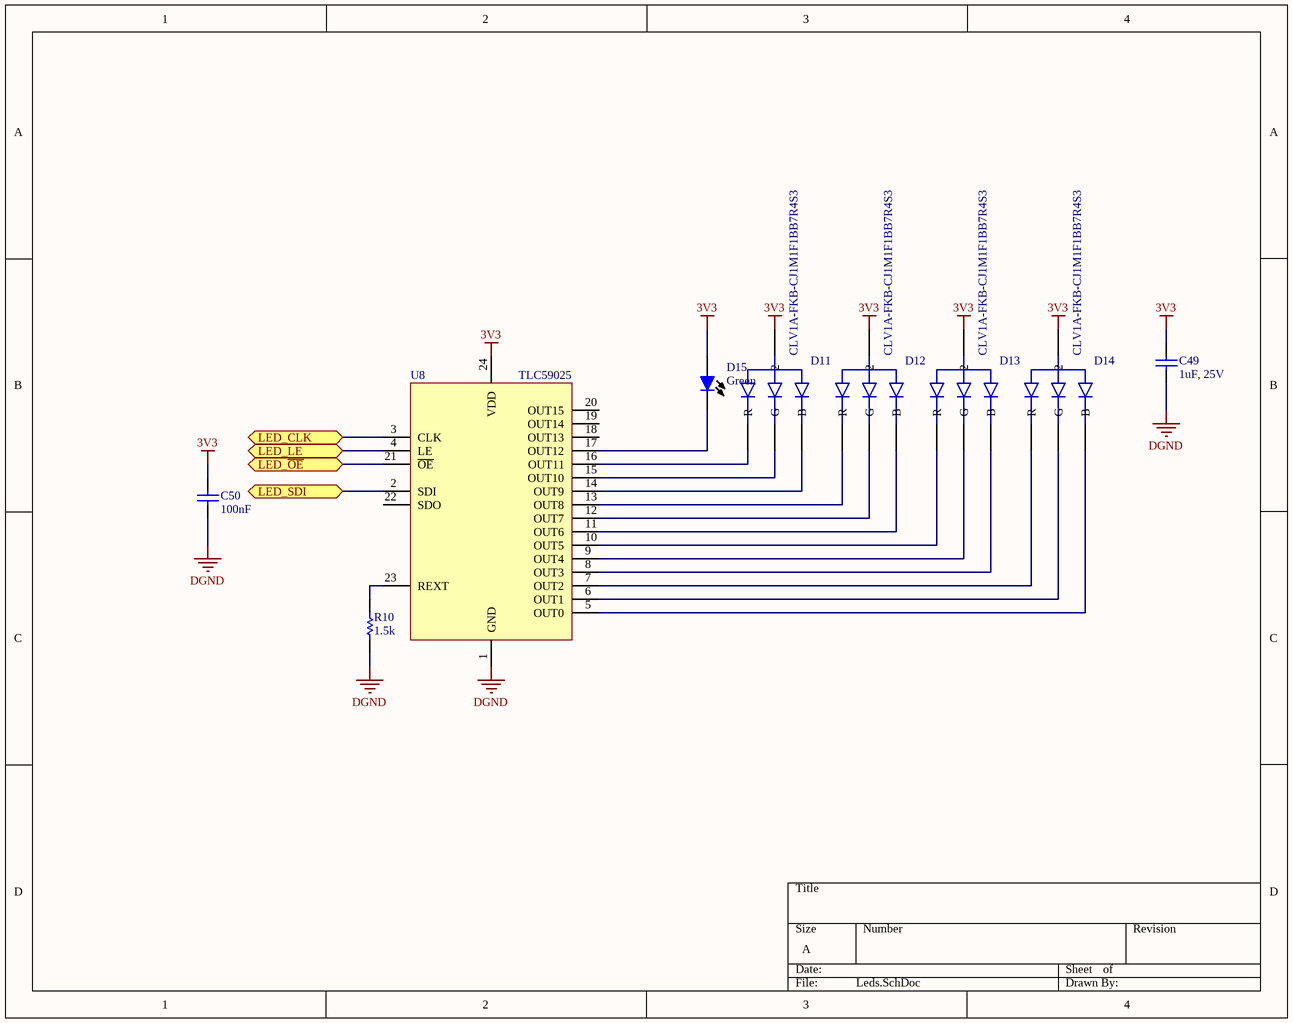
[diagram p6: Leds.SchDoc]

### Parts
C49  1uF, 25V  [CAPC1608L]
C50  100nF  [CAPC1608L]
D11  CLV1A-FKB-CJ1M1F1BB7R4S3  [RGB_LED_PLCC4]
D12  CLV1A-FKB-CJ1M1F1BB7R4S3  [RGB_LED_PLCC4]
D13  CLV1A-FKB-CJ1M1F1BB7R4S3  [RGB_LED_PLCC4]
D14  CLV1A-FKB-CJ1M1F1BB7R4S3  [RGB_LED_PLCC4]
D15  Color: Green  [CD1608-0603]  (hidden comment: LED Green)
R10  1.5k  [RESC1608L]
U8  TLC59025  [SOP24]

### Ports
LED_CLK, LED_LE, LED_SDI, LED_~{OE}

### Nets
3V3: C49.2 C50.2 D11.2 D12.2 D13.2 D14.2 D15.1(A) U8.24(VDD)
DGND: C49.1 C50.1 R10.1 U8.1(GND)
NetD11_1: D11.1(R) U8.16(OUT11)
NetD11_3: D11.3(B) U8.14(OUT9)
NetD11_4: D11.4(G) U8.15(OUT10)
NetD12_1: D12.1(R) U8.13(OUT8)
NetD12_3: D12.3(B) U8.11(OUT6)
NetD12_4: D12.4(G) U8.12(OUT7)
NetD13_1: D13.1(R) U8.10(OUT5)
NetD13_3: D13.3(B) U8.8(OUT3)
NetD13_4: D13.4(G) U8.9(OUT4)
NetD14_1: D14.1(R) U8.7(OUT2)
NetD14_3: D14.3(B) U8.5(OUT0)
NetD14_4: D14.4(G) U8.6(OUT1)
NetD15_2: D15.2(C) U8.17(OUT12)
NetR10_2: R10.2 U8.23(REXT)
NetU4_8: U8.3(CLK) ; port LED_CLK
NetU4_21: U8.4(LE) ; port LED_LE
NetU4_22: U8.21(~{OE}) ; port LED_~{OE}
NetU4_23: U8.2(SDI) ; port LED_SDI

Not connected (* = marked no-connect by the designer): U8 18(OUT13) 19(OUT14) 20(OUT15) 22(SDO)

### Library data of the parts
C49 C50 = Cap Semi: Capacitor (Semiconductor SIM Model); Published: 8-Jun-2000; LatestRevisionDate: 29-May-2009; LatestRevisionNote: IPC-7351 Footprint Added.; PackageReference: C1206; Publisher: Altium Limited; PackageDescription: Chip Capacitor
  C49: Value: 1uF, 25V
  C50: Value: 100nF
D11-D14 = RGB_LED_COMMON_ANODE
D15 = LED
R10 = Res Semi: Semiconductor Resistor; Published: 8-Jun-2000; LatestRevisionDate: 17-Jul-2002; LatestRevisionNote: Re-released for DXP Platform.; PackageReference: AXIAL-0.5; Publisher: Altium Limited; Value: 1.5k

## Nets that join several sheets
3V3: dsPIC (15 pins), Connectors (5 pins), Power_onboard (C46.2 R34.2 U9.5), Leds (8 pins)
5V: dsPIC (C53.1 D19.1 LS1.1), Connectors (P9.6), CurrentSensor (F4.2), Power_onboard (8 pins)
24V: Power_24V (8 pins), Connectors (P2.5 P3.5 P4.5 P6.2)
AGND: dsPIC (C9.1 F6.2 U4.24), CurrentSensor (6 pins), Power_onboard (C43.1 R30.1)
DGND: dsPIC (17 pins), Connectors (P5.4 P9.1 P10.4), Power_onboard (20 pins), Leds (C49.1 C50.1 R10.1 U8.1)
GND: Power_24V (22 pins), Connectors (10 pins), Power_6V (20 pins), Power_onboard (F1.1)
VBAT: Connectors (F3.2), CurrentSensor (U3.1 U3.2), Power_onboard (Q1.2 R11.2)
VDIG: Connectors (P2.1 P3.1 P4.1 P7.2), Power_6V (C33.1 C36.2 L3.2 R23.2)
VIN: Power_24V (5 pins), CurrentSensor (U3.3 U3.4), Power_6V (6 pins)
VSERVO: Connectors (P2.4 P3.4 P4.4 P8.2), Power_6V (C27.1 C31.2 L2.2 R20.2)
NetC4_2: dsPIC (U4.28), CurrentSensor (C4.2 R4.1 R5.2)
NetC43_2: dsPIC (U4.27), Power_onboard (C43.2 R27.1 R30.2)
NetD17_3: dsPIC (U4.20), Power_onboard (D17.3 Q2.3)
NetP5_2: dsPIC (U6.6), Connectors (P5.2 P10.2)
NetP5_3: dsPIC (U6.7), Connectors (P5.3 P10.3)
NetP9_3: dsPIC (U4.14), Connectors (P9.3 R8.1)
NetP9_4: dsPIC (U4.15), Connectors (P9.4 R9.1)
NetP9_5: dsPIC (U4.18), Connectors (P9.5)
NetQ3_1: dsPIC (U4.3), Power_onboard (Q3.1)
NetR37_2: dsPIC (U4.7), Power_6V (R37.2)
NetR38_2: dsPIC (U4.9), Power_6V (R38.2)
NetR39_2: dsPIC (U4.4), Power_24V (R39.2)
NetU4_8: dsPIC (U4.8), Leds (U8.3)
NetU4_21: dsPIC (U4.21), Leds (U8.4)
NetU4_22: dsPIC (U4.22), Leds (U8.21)
NetU4_23: dsPIC (U4.23), Leds (U8.2)